# Altium schematic sheet [03] - USB.SchDoc
size A4
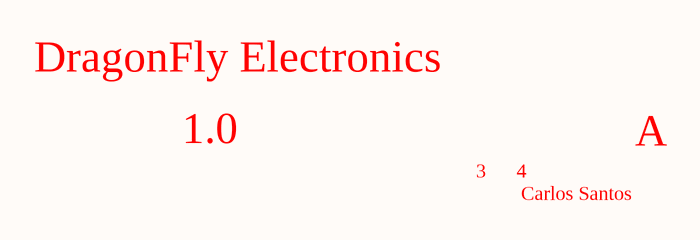
[diagram p0: [03] - USB.SchDoc]

## Notes on the sheet
- DragonFly Electronics
- 1.0
- 3
- 4
- A
- Carlos Santos